# EAGLE design Gaga_Soundsystem_new (EAGLE 6.5.0)
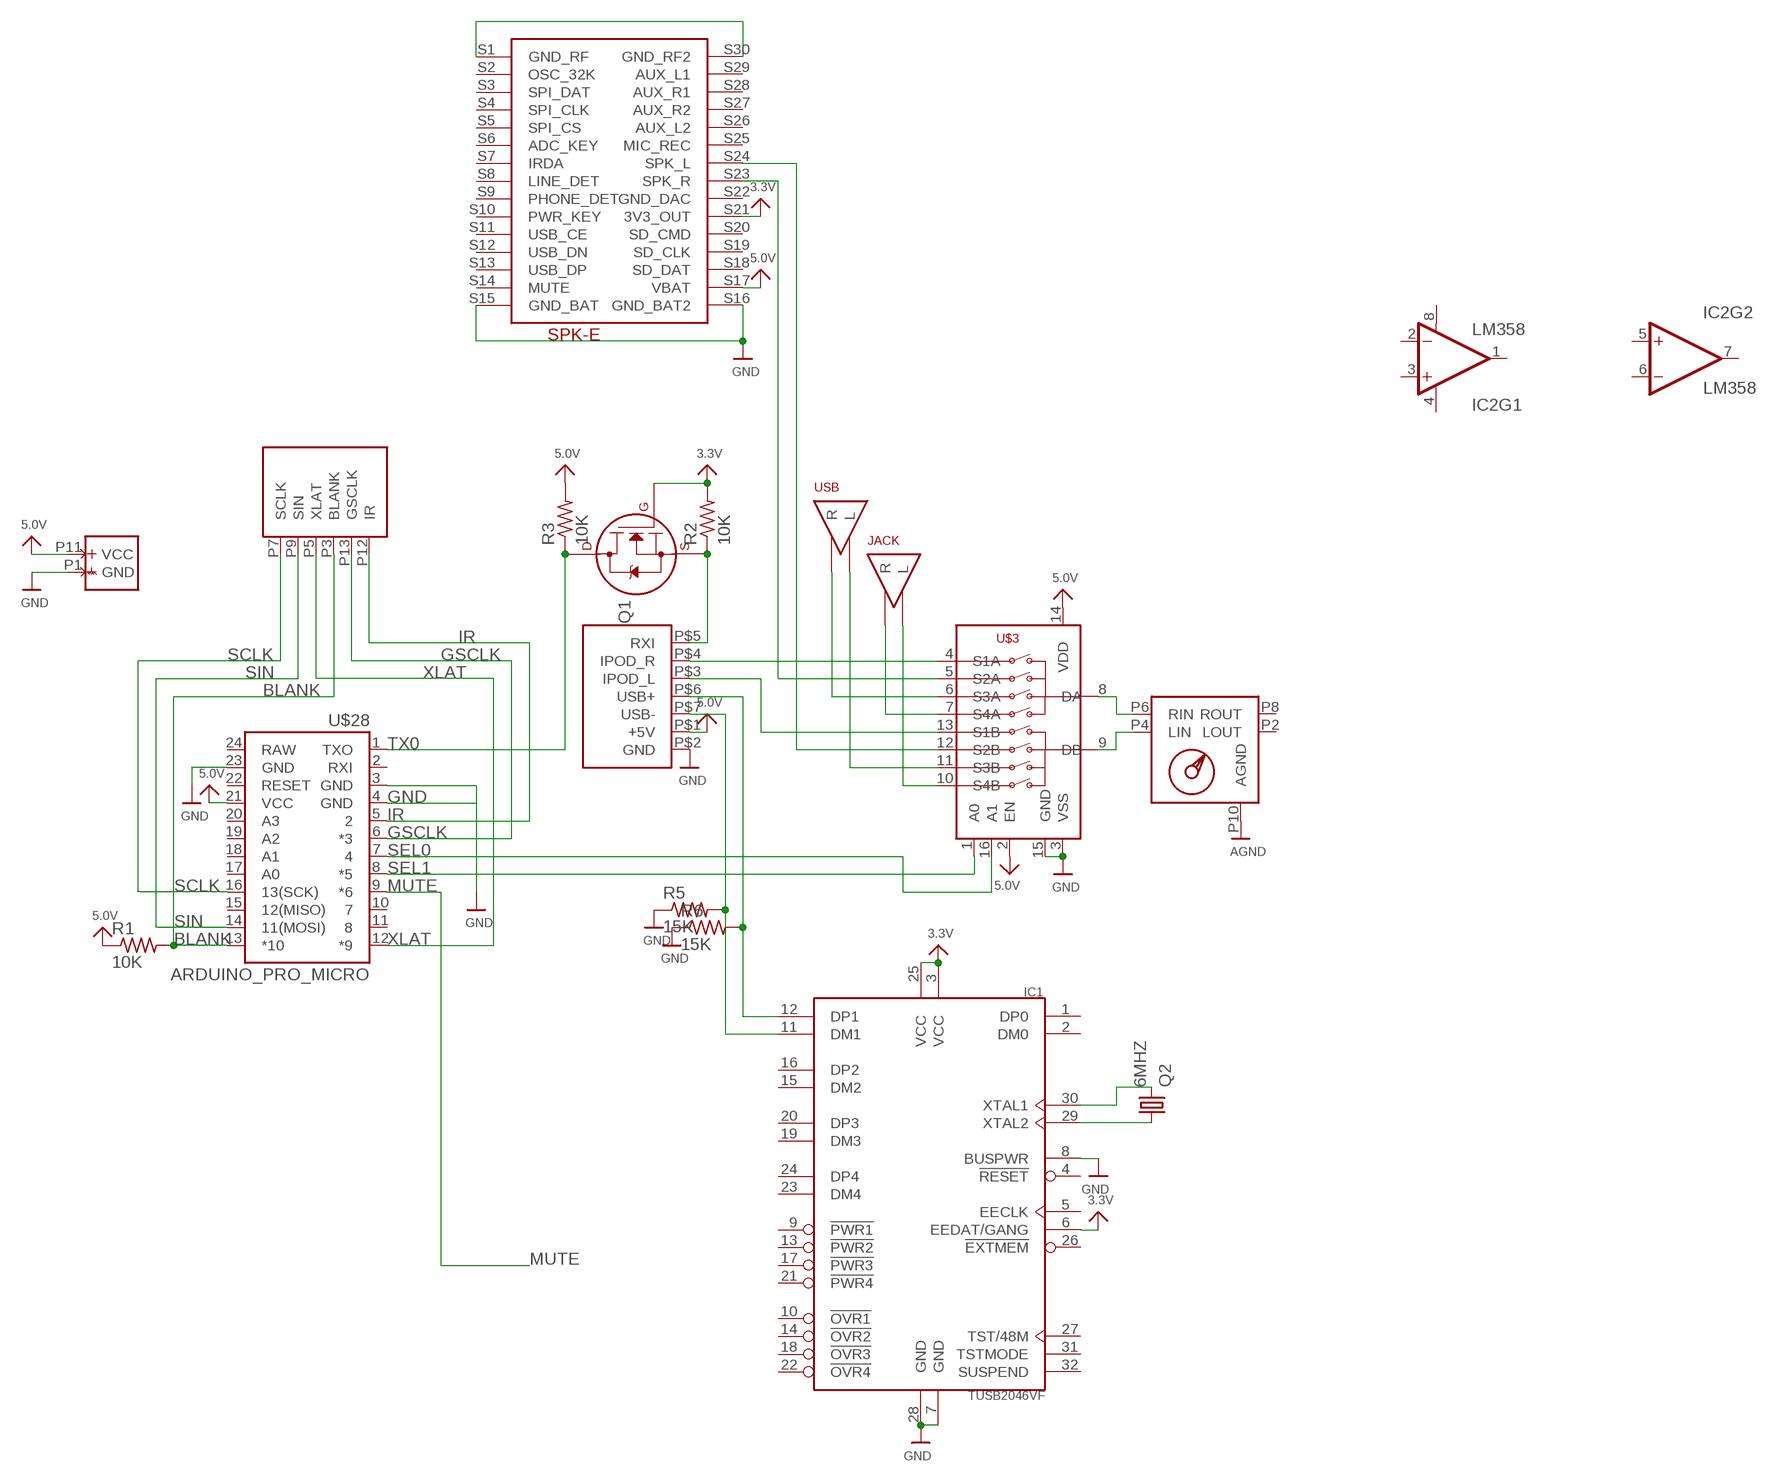
[diagram p0: schematic, sheet 1]

## Parts
IC1  TUSB2046VF  [TQFP32-08]
IC2  LM358  [DIP08]
JACK  JACK  AUDIOCON  [AUDIOCON]
Q1  2N7000_TO92  [TO-92]
Q2  6MHZ  CRYSTALHC49S  [HC49/S]
R1  10K  R-US_0207/7  [0207/7]
R2  10K  R-US_M0805  [M0805]
R3  10K  R-US_R0805  [R0805]
R5  15K  R-US_R0805  [R0805]
R6  15K  R-US_R0805  [R0805]
U$1  OTHERSIDE  [OTHERSIDE]
U$3  ADG709  [TSSOP16]
U$5  IPODCON  [IPODCON]
U$7  SPK-E  [SPK-E]
U$28  ARDUINO_PRO_MICRO  [ARDUINO_PRO_MICRO]
USB  USB  AUDIOCON  [AUDIOCON]

## Nets
3.3V: IC1.3(VCC) IC1.6(EEDAT/GANG) IC1.25(VCC) Q1.2(G) R2.2 U$7.S21(3V3_OUT)
5.0V: R1.1 R3.2 U$1.P11(VCC) U$3.2(EN) U$3.14(VDD) U$5.P$1(+5V) U$7.S17(VBAT) U$28.21(VCC)
AGND: U$1.P10(AGND)
BLANK: R1.2 U$1.P3(BLANK) U$28.13(*10)
BLUL: U$3.12(S2B) U$7.S24(SPK_L)
BLUR: U$3.5(S2A) U$7.S23(SPK_R)
GND: IC1.7(GND) IC1.8(BUSPWR) IC1.28(GND) R5.1 R6.1 U$1.P1(GND) U$3.3(VSS) U$3.15(GND) U$5.P$2(GND) U$7.S15(GND_BAT) U$7.S16(GND_BAT2) U$28.3(GND) U$28.4(GND) U$28.23(GND)
GND_RF: U$7.S1(GND_RF) U$7.S30(GND_RF2)
GSCLK: U$1.P13(GSCLK) U$28.6(*3)
IPODL: U$3.13(S1B) U$5.P$3(IPOD_L)
IPODR: U$3.4(S1A) U$5.P$4(IPOD_R)
IR: U$1.P12(IR) U$28.5
JACKL: JACK.P$2(L) U$3.10(S4B)
JACKR: JACK.P$1(R) U$3.7(S4A)
LIN: U$1.P4(LIN) U$3.9(DB)
MUTE: U$28.9(*6)
N$1: Q1.1(S) R2.1 U$5.P$5(RXI)
N$2: IC1.29(XTAL2) Q2.1
N$5: IC1.30(XTAL1) Q2.2
N$6: IC1.12(DP1) R6.2 U$5.P$6(USB+)
N$7: IC1.11(DM1) R5.2 U$5.P$7(USB-)
RIN: U$1.P6(RIN) U$3.8(DA)
SCLK: U$1.P7(SCLK) U$28.16(13(SCK))
SEL0: U$3.16(A1) U$28.7
SEL1: U$3.1(A0) U$28.8(*5)
SIN: U$1.P9(SIN) U$28.14(11(MOSI))
TX0: Q1.3(D) R3.1 U$28.1(TXO)
USBL: U$3.11(S3B) USB.P$2(L)
USBR: U$3.6(S3A) USB.P$1(R)
XLAT: U$1.P5(XLAT) U$28.12(*9)
Unconnected: IC1.1(DP0) IC1.2(DM0) IC1.4(!RESET) IC1.5(EECLK) IC1.9(!PWR1) IC1.10(!OVR1) IC1.13(!PWR2) IC1.14(!OVR2) IC1.15(DM2) IC1.16(DP2) IC1.17(!PWR3) IC1.18(!OVR3) IC1.19(DM3) IC1.20(DP3) IC1.21(!PWR4) IC1.22(!OVR4) IC1.23(DM4) IC1.24(DP4) IC1.26(!EXTMEM) IC1.27(TST/48M) IC1.31(TSTMODE) IC1.32(SUSPEND) IC2.1(OUT) IC2.2(-IN) IC2.3(+IN) IC2.5(+IN) IC2.6(-IN) IC2.7(OUT) U$1.P2(LOUT) U$1.P8(ROUT) U$7.S2(OSC_32K) U$7.S3(SPI_DAT) U$7.S4(SPI_CLK) U$7.S5(SPI_CS) U$7.S6(ADC_KEY) U$7.S7(IRDA) U$7.S8(LINE_DET) U$7.S9(PHONE_DET) U$7.S10(PWR_KEY) U$7.S11(USB_CE) U$7.S12(USB_DN) U$7.S13(USB_DP) U$7.S14(MUTE) U$7.S18(SD_DAT) U$7.S19(SD_CLK) U$7.S20(SD_CMD) U$7.S22(GND_DAC) U$7.S25(MIC_REC) U$7.S26(AUX_L2) U$7.S27(AUX_R2) U$7.S28(AUX_R1) U$7.S29(AUX_L1) U$28.2(RXI) U$28.10 U$28.11 U$28.15(12(MISO)) U$28.17(A0) U$28.18(A1) U$28.19(A2) U$28.20(A3) U$28.22(RESET) U$28.24(RAW)

## Power pins joined to a net without a drawn wire
V+: IC2.8(V+)
V-: IC2.4(V-)

## Library data of the parts
IC1 = jt-texas:TUSB2046: 4-port full speed USB hub (USB1.1)
IC2 = SparkFun-AnalogIC:LM358: Jellybean op-amp; PROD_ID: IC-09172
JACK USB = connector:AUDIOCON
Q1 = transistors:2N700*: 2N7000, 2N7002, NDS7002A N-channel enhancement mode MOSFET
Q2 = crystal:CRYSTAL: CRYSTAL; OC_FARNELL: 1667008; OC_NEWARK: unknown
R1-R3 R5 R6 = resistor:R-US_: RESISTOR, American symbol
U$1 = connector:OTHERSIDE
U$3 = ADG709:ADG709
U$5 = connector:IPODCON
U$7 = BLK:SPK-E
U$28 = SparkFun-Boards:ARDUINO_PRO_MICRO

## Net classes
0 default: clearance 0.355 mm

## Board
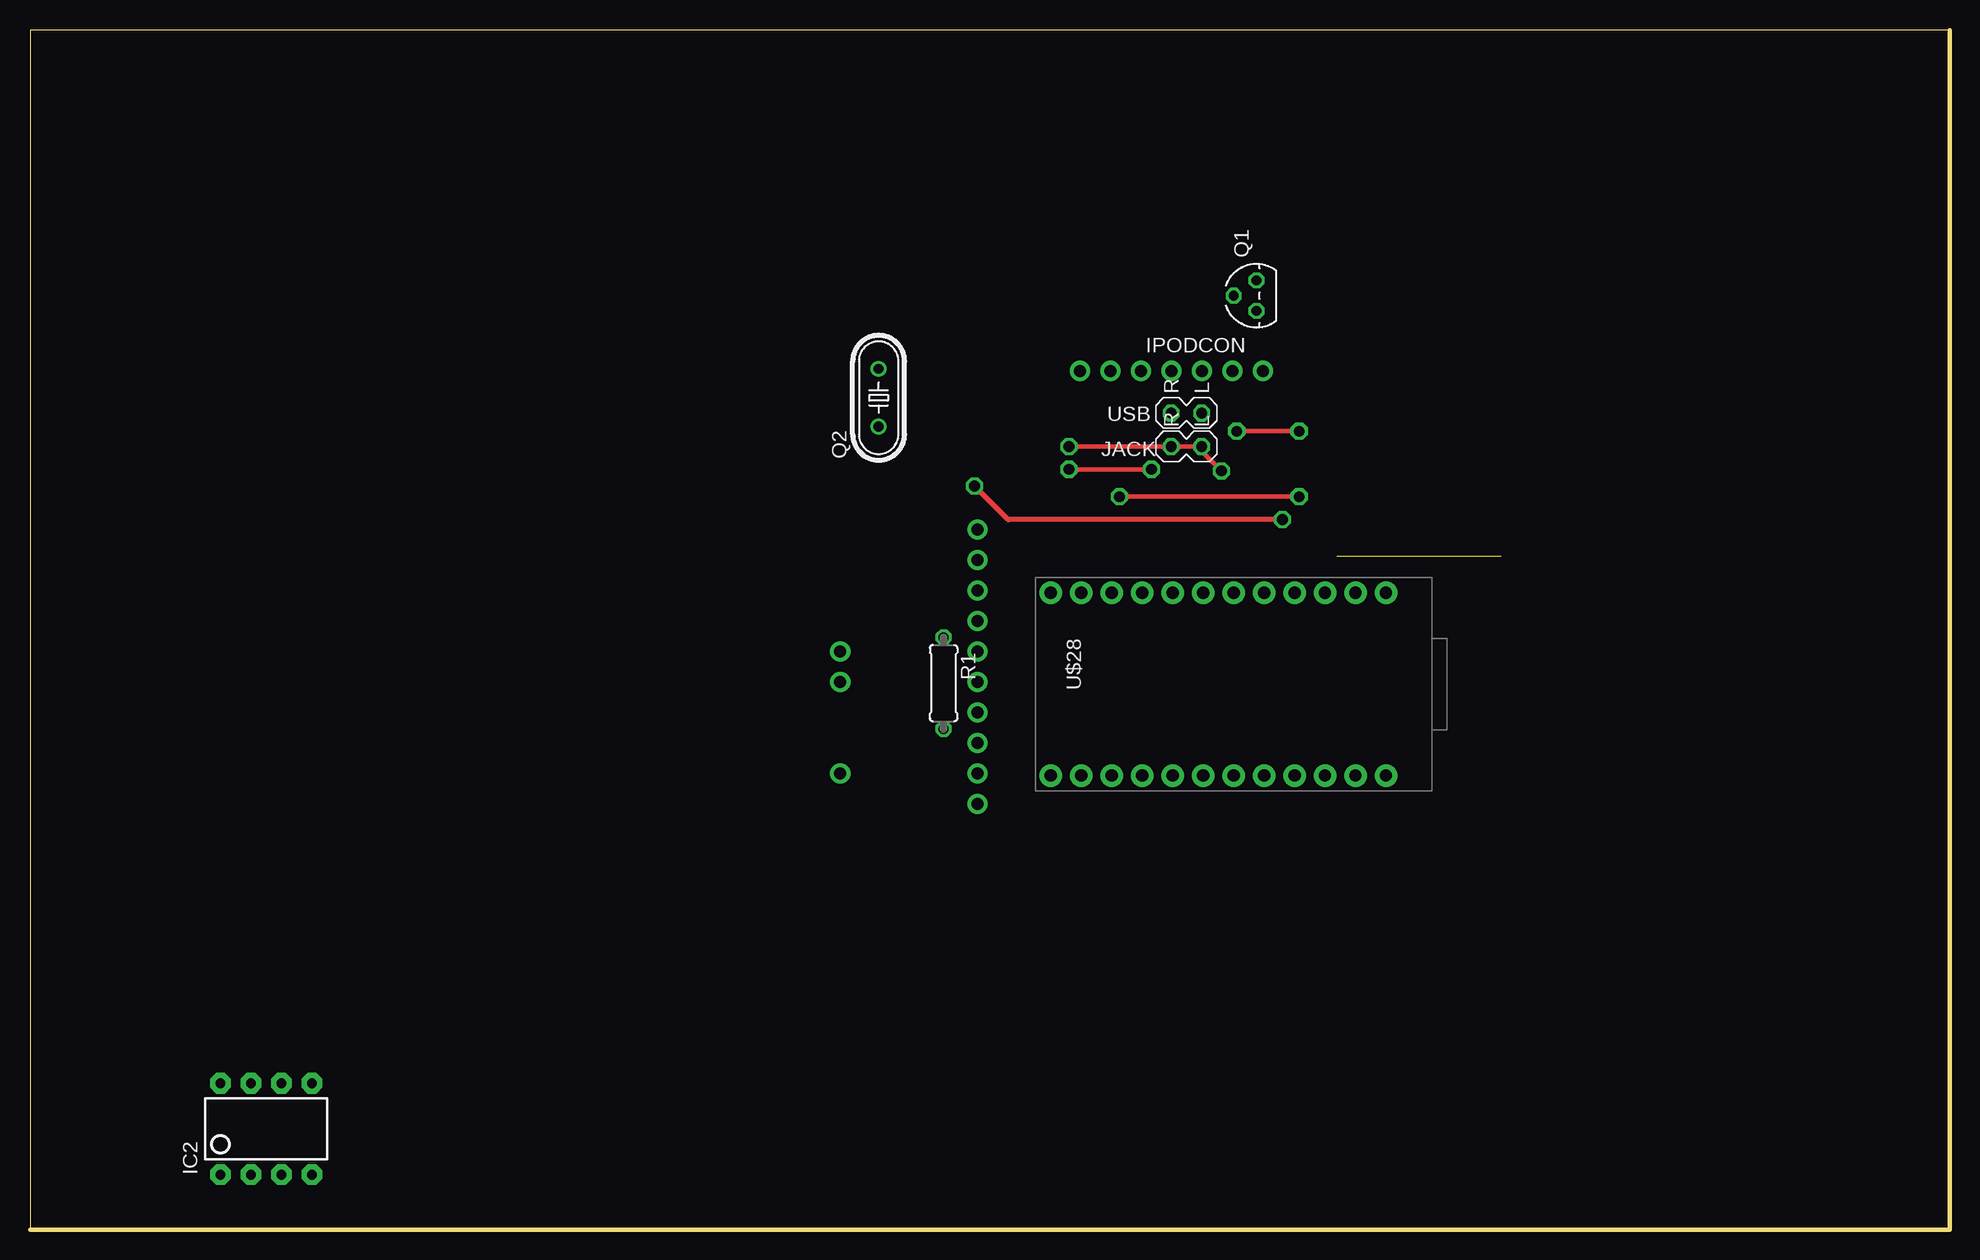
[diagram p1: board, top side]
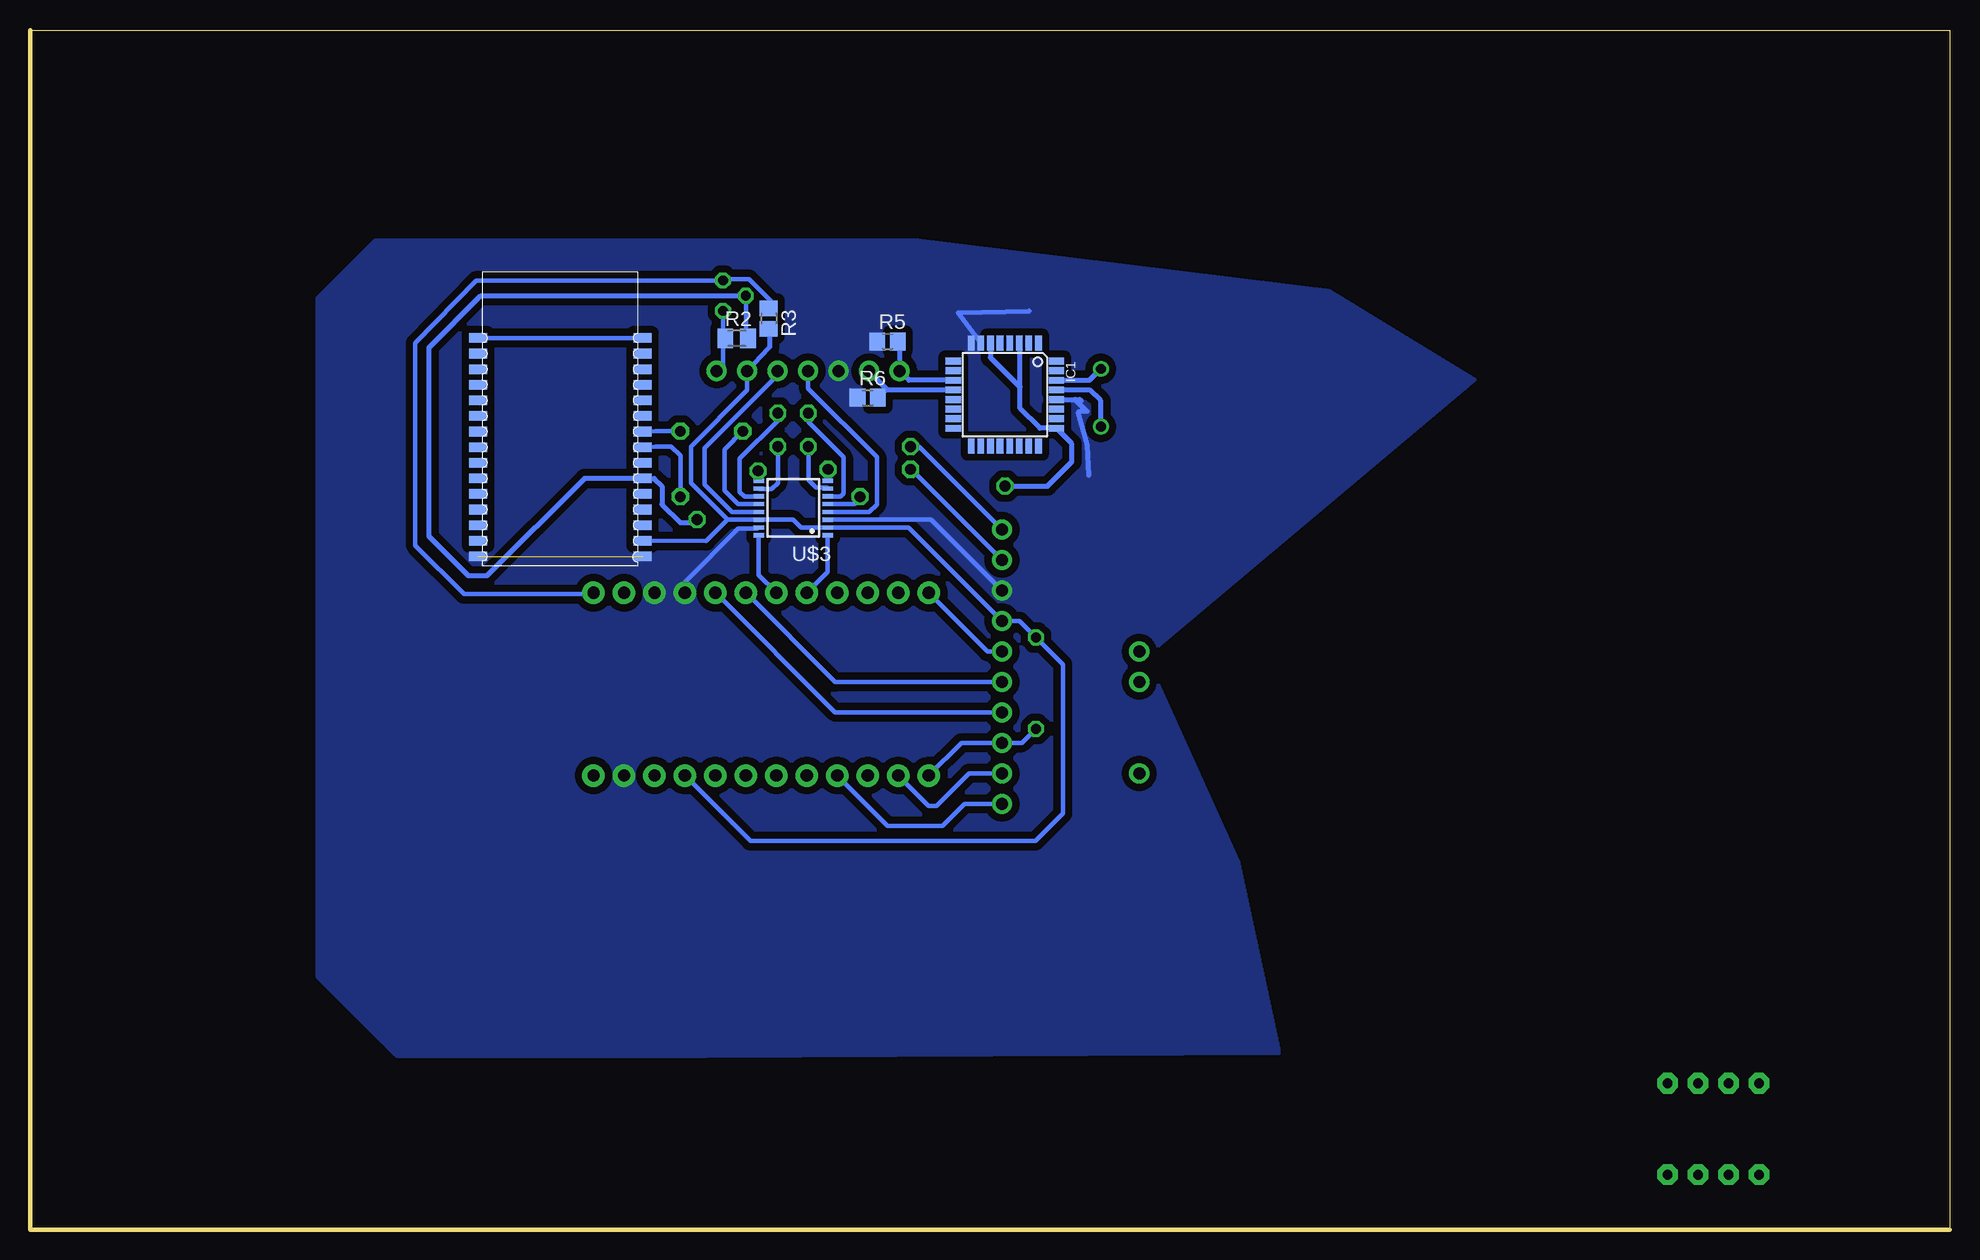
[diagram p2: board, bottom side, seen from below]

Size 160 x 100 mm. Coordinates in mm from the lower left corner, seen from the top.
Outline: 0,0 160,0 160,100 0,100 0,0
Copper layers (1*16): Top 0.035mm / dielectric 1.5mm / Bottom 0.035mm
Design rules "default *": minimum track width 14mil, minimum drill 24mil, track to track 12mil, track to pad 8mil, pad to pad 8mil, via to via 8mil, smd to smd 8mil, copper to edge 40mil, drill to drill 8mil, minimum pad ring 10mil, minimum via ring 8mil, stop-mask expansion 4mil, vias tented up to drill 0mil, thermal gap 10mil

### Footprints (pad centres in the part's own frame; a part is rotated, then mirrored left to right if it is on the bottom)
TQFP32-08 = smd 1.27 x 0.559: 1 -4.293,2.8; 2 -4.293,2; 3 -4.293,1.2; 4 -4.293,0.4; 5 -4.293,-0.4; 6 -4.293,-1.2; 7 -4.293,-2; 8 -4.293,-2.8; 17 4.293,-2.8; 18 4.293,-2; 19 4.293,-1.2; 20 4.293,-0.4; 21 4.293,0.4; 22 4.293,1.2; 23 4.293,2; 24 4.293,2.8 | smd 0.559 x 1.27: 9 -2.8,-4.293; 10 -2,-4.293; 11 -1.2,-4.293; 12 -0.4,-4.293; 13 0.4,-4.293; 14 1.2,-4.293; 15 2,-4.293; 16 2.8,-4.293; 25 2.8,4.293; 26 2,4.293; 27 1.2,4.293; 28 0.4,4.293; 29 -0.4,4.293; 30 -1.2,4.293; 31 -2,4.293; 32 -2.8,4.293
DIP08 = drill 0.813 pad 1.727 octagon: 1 -3.81,-3.81; 2 -1.27,-3.81; 3 1.27,-3.81; 4 3.81,-3.81; 5 3.81,3.81; 6 1.27,3.81; 7 -1.27,3.81; 8 -3.81,3.81
AUDIOCON = drill 0.9 octagon: P$1 -1.27,0; P$2 1.27,0
TO-92 = drill 0.813 octagon: 1 -1.27,0; 2 0,1.905; 3 1.27,0
HC49/S = drill 0.813: 1 -2.413,0; 2 2.413,0
0207/7 = drill 0.813 octagon: 1 -3.81,0; 2 3.81,0
M0805 = smd 1.3 x 1.6: 1 -0.95,0; 2 0.95,0
R0805 = smd 1.3 x 1.5: 1 -0.85,0; 2 0.85,0
OTHERSIDE = drill 1 pad 1.676: P1 -13.97,10.16; P2 1.27,-1.27; P3 -1.27,10.16; P4 -19.05,10.16; P5 -8.89,10.16; P6 -16.51,10.16; P7 3.81,10.16; P8 -6.35,-1.27; P9 1.27,10.16; P10 -8.89,-1.27; P11 -11.43,10.16; P12 -3.81,10.16; P13 -6.35,10.16
TSSOP16 = smd 0.9 x 0.35: 1 -2.875,2.275; 2 -2.875,1.625; 3 -2.875,0.975; 4 -2.875,0.325; 5 -2.875,-0.325; 6 -2.875,-0.975; 7 -2.875,-1.625; 8 -2.875,-2.275; 9 2.875,-2.275; 10 2.875,-1.625; 11 2.875,-0.975; 12 2.875,-0.325; 13 2.875,0.325; 14 2.875,0.975; 15 2.875,1.625; 16 2.875,2.275
IPODCON = drill 1 pad 1.676: P$1 -2.54,0; P$2 5.08,0; P$3 0,0; P$4 2.54,0; P$5 -5.08,0; P$6 7.62,0; P$7 10.16,0
SPK-E = smd 1.5 x 0.8: S1 -0.35,18.95; S2 -0.35,17.65; S3 -0.35,16.35; S4 -0.35,15.05; S5 -0.35,13.75; S6 -0.35,12.45; S7 -0.35,11.15; S8 -0.35,9.85; S9 -0.35,8.55; S10 -0.35,7.25; S11 -0.35,5.95; S12 -0.35,4.65; S13 -0.35,3.35; S14 -0.35,2.05; S15 -0.35,0.75; S16 13.35,0.75; S17 13.35,2.05; S18 13.35,3.35; S19 13.35,4.65; S20 13.35,5.95; S21 13.35,7.25; S22 13.35,8.55; S23 13.35,9.85; S24 13.35,11.15; S25 13.35,12.45; S26 13.35,13.75; S27 13.35,15.05; S28 13.35,16.35; S29 13.35,17.65; S30 13.35,18.95
ARDUINO_PRO_MICRO = drill 1.016 pad 1.88: 1 -7.62,12.7; 2 -7.62,10.16; 3 -7.62,7.62; 4 -7.62,5.08; 5 -7.62,2.54; 6 -7.62,0; 7 -7.62,-2.54; 8 -7.62,-5.08; 9 -7.62,-7.62; 10 -7.62,-10.16; 11 -7.62,-12.7; 12 -7.62,-15.24; 13 7.62,-15.24; 14 7.62,-12.7; 15 7.62,-10.16; 16 7.62,-7.62; 17 7.62,-5.08; 18 7.62,-2.54; 19 7.62,0; 20 7.62,2.54; 21 7.62,5.08; 22 7.62,7.62; 23 7.62,10.16; 24 7.62,12.7

### Placement (x,y rotation side)
IC1  78.74,69.6 270 bottom
IC2  19.68,8.38 0 top
JACK  96.39,65.28 0 top
Q1  102.23,77.85 90 top
Q2  70.74,69.34 90 top
R1  76.15,45.55 270 top
R2  101.09,74.3 0 bottom
R3  98.42,75.95 270 bottom
R5  88.52,74.04 0 bottom
R6  90.17,69.34 0 bottom
U$1  68.81,39.3 270 top
U$3  96.38,60.15 180 bottom
U$5  97.68,71.58 180 top
U$7  122.3,55.37 0 bottom
U$28  100.33,45.47 270 top
USB  96.39,68.07 0 top

### Tracks (layer width: path | path; a pad name or v marks a point on that pad's centre or on a via)
3.3V  (via drill 0.9 pad 1.42)
  Top 0.406: v104.39,59.18 81.53,59.18 v78.74,61.98
  Bottom 0.356: Q1.2 100.33,74.55
  Bottom 0.406: 77.47,70.23 77.47,68.45 75.81,66.8 IC1.25 73.15,65.5 73.15,64.01 75.18,61.98 v78.74,61.98 | 77.47,70.23 77.47,73.82 IC1.3 | v104.39,59.18 104.65,58.93 105.79,58.93 107.31,60.45 107.31,61.98 107.96,62.62 U$7.S21 113.78,62.62 121.92,54.48 123.44,54.48 126.75,57.78 126.75,73.53 122.43,77.85 Q1.2 | IC1.6 79.94,72.7 77.47,70.23 | R2.2 100.33,74.3 100.33,74.55
5.0V
  Bottom 0.356: 101.85,59.17 U$3.14 99.25,59.18 96.39,59.18 95.74,58.52 U$3.2 86.77,58.52 U$1.P11 77.52,50.73 R1.1 73.91,47.12 73.91,34.67 76.2,32.38 99.95,32.38 U$28.21 | 101.85,59.17 104.9,62.23 104.9,65.28 100.22,69.96 U$5.P$1 98.42,73.5 98.34,73.58 98.39,73.53 | U$7.S17 103.63,57.4 101.85,59.17
  Bottom 0.406: R3.2 98.34,74.97 98.34,73.58
BLANK
  Bottom 0.356: U$28.13 82.37,40.56 U$1.P3 77.32,40.56 R1.2
BLUL  (via drill 0.9 pad 1.42)
  Top 0.356: v100.58,66.55 v105.79,66.55
  Bottom 0.356: U$3.12 100.99,60.48 102.11,61.59 102.11,65.02 v100.58,66.55 | v105.79,66.55 107.86,66.55 U$7.S24
BLUR  (via drill 0.9 pad 1.42)
  Top 0.356: v90.81,61.09 v105.79,61.09
  Bottom 0.356: U$3.5 91.29,60.48 90.81,60.96 v90.81,61.09 | v105.79,61.09 105.79,64.52 106.55,65.28 107.85,65.28 U$7.S23
GND  (1 unrouted)
  Bottom 0.356: 92.46,59.17 U$3.3 84.88,59.17 U$1.P1 | U$3.15 99.36,58.42 100.97,58.42 105.41,53.98 U$28.4
  Bottom 0.406: IC1.7 82.64,76.42 76.71,76.58 | 72.39,69.09 72.5,69.2 IC1.28 72.88,69.2 71.88,68.2 72.52,68.2 72.64,68.07 71.88,65.41 71.75,62.87
  pour Bottom (isolate 0.61, no thermals): 51.69,78.23 39.62,70.87 67.06,47.75 59.31,30.61 55.88,14.73 103.63,14.48 129.41,14.48 136.02,21.08 136.02,77.6 131.19,82.42 85.98,82.42
GND_RF
  Bottom 0.356: U$7.S30 U$7.S1
GSCLK
  Bottom 0.356: U$1.P13 92.89,45.65 U$28.6
IPODL
  Bottom 0.356: U$5.P$3 97.68,71.23 103.76,65.15 103.76,62.1 101.47,59.82 U$3.13
IPODR
  Bottom 0.356: 93.22,59.82 90.04,59.82 89.41,60.45 89.41,64.39 95.14,70.12 U$5.P$4 | 93.22,59.82 93.73,59.82 | U$3.4 93.23,59.83 93.22,59.82
IR
  Bottom 0.356: U$1.P12 92.89,43.1 U$28.5
JACKL
  Bottom 0.356: JACK.P$2 97.66,62.23 98.17,61.72 99.2,61.72 U$3.10
JACKR
  Bottom 0.356: JACK.P$1 95.12,62.48 94.49,61.85 93.58,61.85 U$3.7
LIN  (via drill 0.9 pad 1.42)
  Top 0.356: v99.31,63.25 97.28,65.28 v86.61,65.28
  Bottom 0.356: U$3.9 99.26,63.19 v99.31,63.25 | U$1.P4 85.9,65.28 v86.61,65.28
N$1
  Bottom 0.356: Q1.1 102.23,74.42 102.23,72.1 U$5.P$5
  Bottom 0.406: R2.1 102.23,74.3 102.23,74.42
N$2
  Bottom 0.406: Q2.1 70.74,69.09 71.63,69.98 74.43,69.98 IC1.29
N$5
  Bottom 0.406: IC1.30 71.7,70.8 Q2.2
N$6
  Bottom 0.406: IC1.12 88.52,70 | 88.52,70 88.67,70 R6.2 | U$5.P$6 90.06,71.53 88.52,70
N$7
  Bottom 0.406: R5.2 87.52,74.04 U$5.P$7 86.73,70.8 IC1.11
RIN  (via drill 0.9 pad 1.42)
  Top 0.356: v93.47,63.37 v86.61,63.37
  Bottom 0.356: U$3.8 93.51,63.34 v93.47,63.37 | U$1.P6 86.54,63.37 v86.61,63.37
SCLK
  Bottom 0.356: U$1.P7 82.12,35.48 83.95,33.66 88.52,33.66 U$28.16
SEL0
  Bottom 0.356: U$3.16 99.26,54.55 U$28.7
SEL1
  Bottom 0.356: U$3.1 93.51,54.83 U$28.8
SIN
  Bottom 0.356: U$1.P9 81.74,38.02 84.45,35.31 85.09,35.31 U$28.14
TX0
  Bottom 0.356: 97.92,77.09 100.08,79.25 102.11,79.25 Q1.3 122.81,79.12 127.89,73.91 127.89,57.02 123.83,52.96 113.16,52.96 U$28.1
  Bottom 0.406: R3.1 97.92,77.09
USBL
  Bottom 0.356: USB.P$2 97.66,67.44 100.84,64.26 100.84,61.47 100.46,61.09 99.29,61.09 U$3.11
USBR
  Bottom 0.356: USB.P$1 95.12,67.31 92.2,64.39 92.2,61.34 92.46,61.09 93.47,61.09 U$3.6
XLAT
  Bottom 0.356: U$1.P5 80.19,48.19 U$28.12